# Altium schematic sheet LEO_COTS_ant_rev1.SchDoc: COTS LEO TX
size A; DocumentNumber: 1; Revision: 1; SheetNumber: 1; SheetTotal: 1
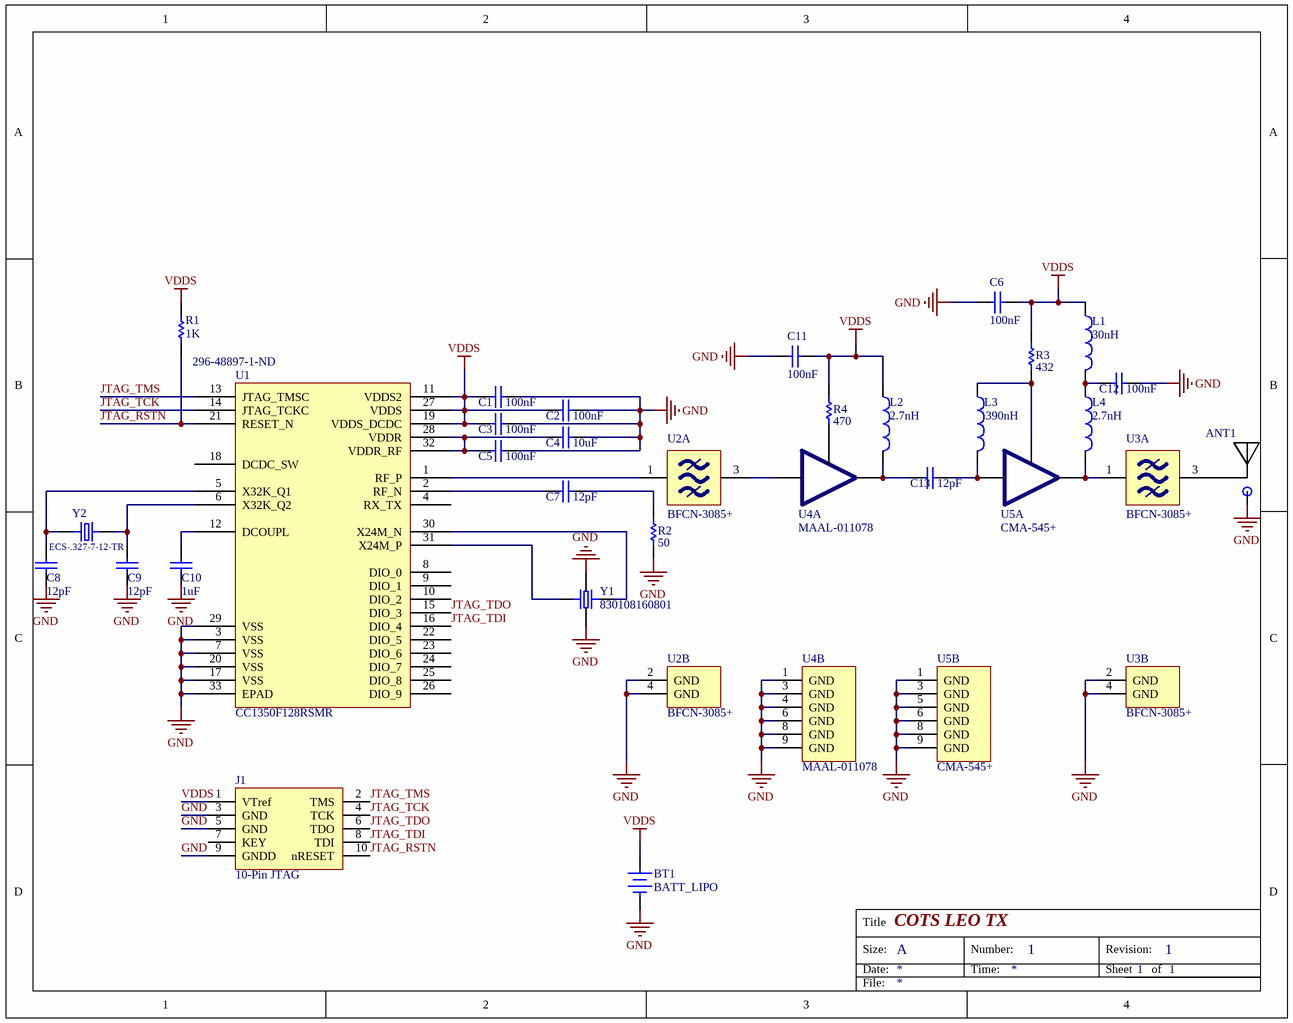
[diagram p0: LEO_COTS_ant_rev1.SchDoc]

## Parts
ANT1  ANT  [RESLOOP_OD10_fw15_fl180_sw12_sl15]  (value not drawn)  (no BOM)
BT1  BATT_LIPO  [LIPO_1cm_1cm]
C1  value 100nF  [CAPC0603X04N]  (hidden comment: CAP_0201)
C2  value 100nF  [CAPC0603X04N]  (hidden comment: CAP_0201)
C3  value 100nF  [CAPC0603X04N]  (hidden comment: CAP_0201)
C4  value 10uF  [CAPC1608X05N]  (hidden comment: CAP_0603)
C5  value 100nF  [CAPC0603X04N]  (hidden comment: CAP_0201)
C6  value 100nF  [CAPC0603X04N]  (hidden comment: CAP_0201)
C7  value 12pF  [CAPC0603X04N]  (hidden comment: CAP_0201)
C8  value 12pF  [CAPC0603X04N]  (hidden comment: CAP_0201)
C9  value 12pF  [CAPC0603X04N]  (hidden comment: CAP_0201)
C10  value 1uF  [CAPC0603X04N]  (hidden comment: CAP_0201)
C11  value 100nF  [CAPC0603X04N]  (hidden comment: CAP_0201)
C12  value 100nF  [CAPC0603X04N]  (hidden comment: CAP_0201)
C13  value 12pF  [CAPC0603X04N]  (hidden comment: CAP_0201)
J1  10-Pin JTAG  [FTSH-105-01-F-DV-007-K]
L1  value 30nH  [0402]  (hidden comment: Inductor)
L2  value 2.7nH  [0402]  (hidden comment: Inductor)
L3  value 390nH  [1608[0603]]  (hidden comment: Inductor)
L4  value 2.7nH  [0402]  (hidden comment: Inductor)
R1  value 1K  [CAPC0603X04N]  (hidden comment: RES_0201)
R2  value 50  [CAPC0603X04N]  (hidden comment: RES_0201)
R3  value 432  [CAPC0603X04N]  (hidden comment: RES_0201)
R4  value 470  [CAPC0603X04N]  (hidden comment: RES_0201)
U1  CC1350F128RSMR  Supplier Part Number 1: 296-48897-1-ND  [QFN40P400X400X100-33N]
U2  BFCN-3085+  [FV1206]  (parts A,B of 2)
U3  BFCN-3085+  [FV1206]  (parts A,B of 2)
U4  MAAL-011078  [PDFN-8]  (parts A,B of 2)
U5  CMA-545+  [DL1721]  (parts A,B of 2)
Y1  830108160801  [LFXTAL081608]
Y2  ECS-.327-7-12-TR  [XTAL_ECS-.327-7-12-TR]

## Nets
GND: ANT1.2(-) BT1.2(-) C1.1 C2.1 C3.1 C4.2 C5.1 C6.1 C8.1 C9.1 C10.1 C11.1 C12.1 J1.3(GND) J1.5(GND) J1.9(GNDD) R2.1 U1.3(VSS) U1.7(VSS) U1.17(VSS) U1.20(VSS) U1.29(VSS) U1.33(EPAD) U2.2(GND) U2.4(GND) U3.2(GND) U3.4(GND) U4.1(GND) U4.3(GND) U4.4(GND) U4.6(GND) U4.8(GND) U4.9(GND) U5.1(GND) U5.3(GND) U5.5(GND) U5.6(GND) U5.8(GND) U5.9(GND) Y1.2 Y1.4
VDDS: BT1.1(+) C1.2 C2.2 C3.2 C6.2 C11.2 J1.1(VTref) L1.1 L2.1 R1.2 R3.2 R4.2 U1.11(VDDS2) U1.19(VDDS_DCDC) U1.27(VDDS)
JTAG_RSTN: J1.10(nRESET) R1.1 U1.21(RESET_N)
JTAG_TCK: J1.4(TCK) U1.14(JTAG_TCKC)
JTAG_TDI: J1.8(TDI) U1.16(DIO_4)
JTAG_TDO: J1.6(TDO) U1.15(DIO_3)
JTAG_TMS: J1.2(TMS) U1.13(JTAG_TMSC)
NetANT1_1: ANT1.1(+) U3.3(OUT)
NetC4_1: C4.1 C5.2 U1.28(VDDR) U1.32(VDDR_RF)
NetC7_1: C7.1 R2.2
NetC7_2: C7.2 U1.2(RF_N)
NetC8_2: C8.2 U1.5(X32K_Q1) Y2.1
NetC9_2: C9.2 U1.6(X32K_Q2) Y2.2
NetC10_2: C10.2 U1.12(DCOUPL)
NetC12_2: C12.2 L1.2 L4.1
NetC13_1: C13.1 L3.2 U5.2(IN)
NetC13_2: C13.2 L2.2 U4.7(OUT)
NetL3_1: L3.1 R3.1 U5.4(BIAS)
NetL4_2: L4.2 U3.1(IN) U5.7(OUT)
NetR4_1: R4.1 U4.5(BIAS)
NetU1_1: U1.1(RF_P) U2.1(IN)
NetU1_30: U1.30(X24M_N) Y1.3
NetU1_31: U1.31(X24M_P) Y1.1
NetU2_3: U2.3(OUT) U4.2(IN)

Not connected (* = marked no-connect by the designer): J1 7(KEY); U1 4(RX_TX) 8(DIO_0) 9(DIO_1) 10(DIO_2) 18(DCDC_SW) 22(DIO_5) 23(DIO_6) 24(DIO_7) 25(DIO_8) 26(DIO_9)

## Notes on the sheet
- Title
- Size:
- Date:
- A
- Number:
- Time:
- Revision:
- Sheet
- of
- File:

## Library data of the parts
ANT1 = ANT: PCB antenna
C1-C3 C5 C6 C11 C12 = CAP_0201: CAP CER 100nF 0201
C4 = CAP_0603: CAP CER 10uF 0603
C7-C9 C13 = CAP_0201: CAP CER 12pF 0201
  C13: Supplier Part Number 1: 490-11308-1-ND; Supplier 1: Digi-Key
C10 = CAP_0201: CAP CER 1uF 0201
J1 = CM10: Supplier 1: Digi-Key; Supplier Part Number 1: FTSH-105-01-L-DV-007-K-P-ND
L1-L4 = Inductor: Code_IEC: 1005; Published: 8-Jun-2000; LatestRevisionDate: 29-May-2009; LatestRevisionNote: IPC-7351 Footprint Added.; PackageReference: 0402-A; Publisher: Altium Limited; PackageDescription: Chip Inductor; Code_JEITA: 0402; Supplier 1: Digi-Key
  L1: Supplier Part Number 1: 2035-0402HP-300EKTSCT-ND
  L2 L4: Supplier Part Number 1: 2035-1403-1-ND
  L3: Supplier Part Number 1: 490-LQW18CNR39J0ZDCT-ND
R1 = Res Semi: RES 1K OHM 0201; Published: 8-Jun-2000; LatestRevisionDate: 17-Jul-2002; LatestRevisionNote: Re-released for DXP Platform.; PackageReference: AXIAL-0.5; Publisher: Altium Limited; PackageDescription: Axial Device, Thru-Hole; 2 Leads; 0.5 in Pin Spacing
R2-R4 = Res Semi: RES 50 OHM 0201; Published: 8-Jun-2000; LatestRevisionDate: 17-Jul-2002; LatestRevisionNote: Re-released for DXP Platform.; PackageReference: AXIAL-0.5; Publisher: Altium Limited; PackageDescription: Axial Device, Thru-Hole; 2 Leads; 0.5 in Pin Spacing
  R3: Supplier 1: Digi-Key; Supplier Part Number 1: P123009CT-ND
  R4: Supplier 1: Digi-Key; Supplier Part Number 1: P123030CT-ND
U1 = CC1350F128RSMR: Ultra-Low-Power Dual-Band Wireless MCU; Supplier 1: Digi-Key
U2 U3 = BFCN-3085+: 2800 to 3400 MHz Band-Pass Filter; Supplier 1: Mini-Circuits; Supplier Part Number 1: BFCN-3085+
U4 = MAAL-011078: Wideband LNA; Supplier 1: Digi-Key; Supplier Part Number 1: 1465-1489-1-ND; Manufacturer Part Number: MAAL-011078
U5 = CMA-545+: Wideband LNA; Supplier 1: Mini-Circuits; Supplier Part Number 1: CMA-545+
Y1 = 830108160801: 24 MHz crystal; MP: ECS-.327-7-12-TR; Package: None; Price: None; Value: *; Availability: Unavailable
Y2 = ECS-.327-7-12-TR: 32.768 kHz SMD Crystal; Package: None; Price: None; Value: *; MP: ECS-.327-7-12-TR; Availability: Unavailable